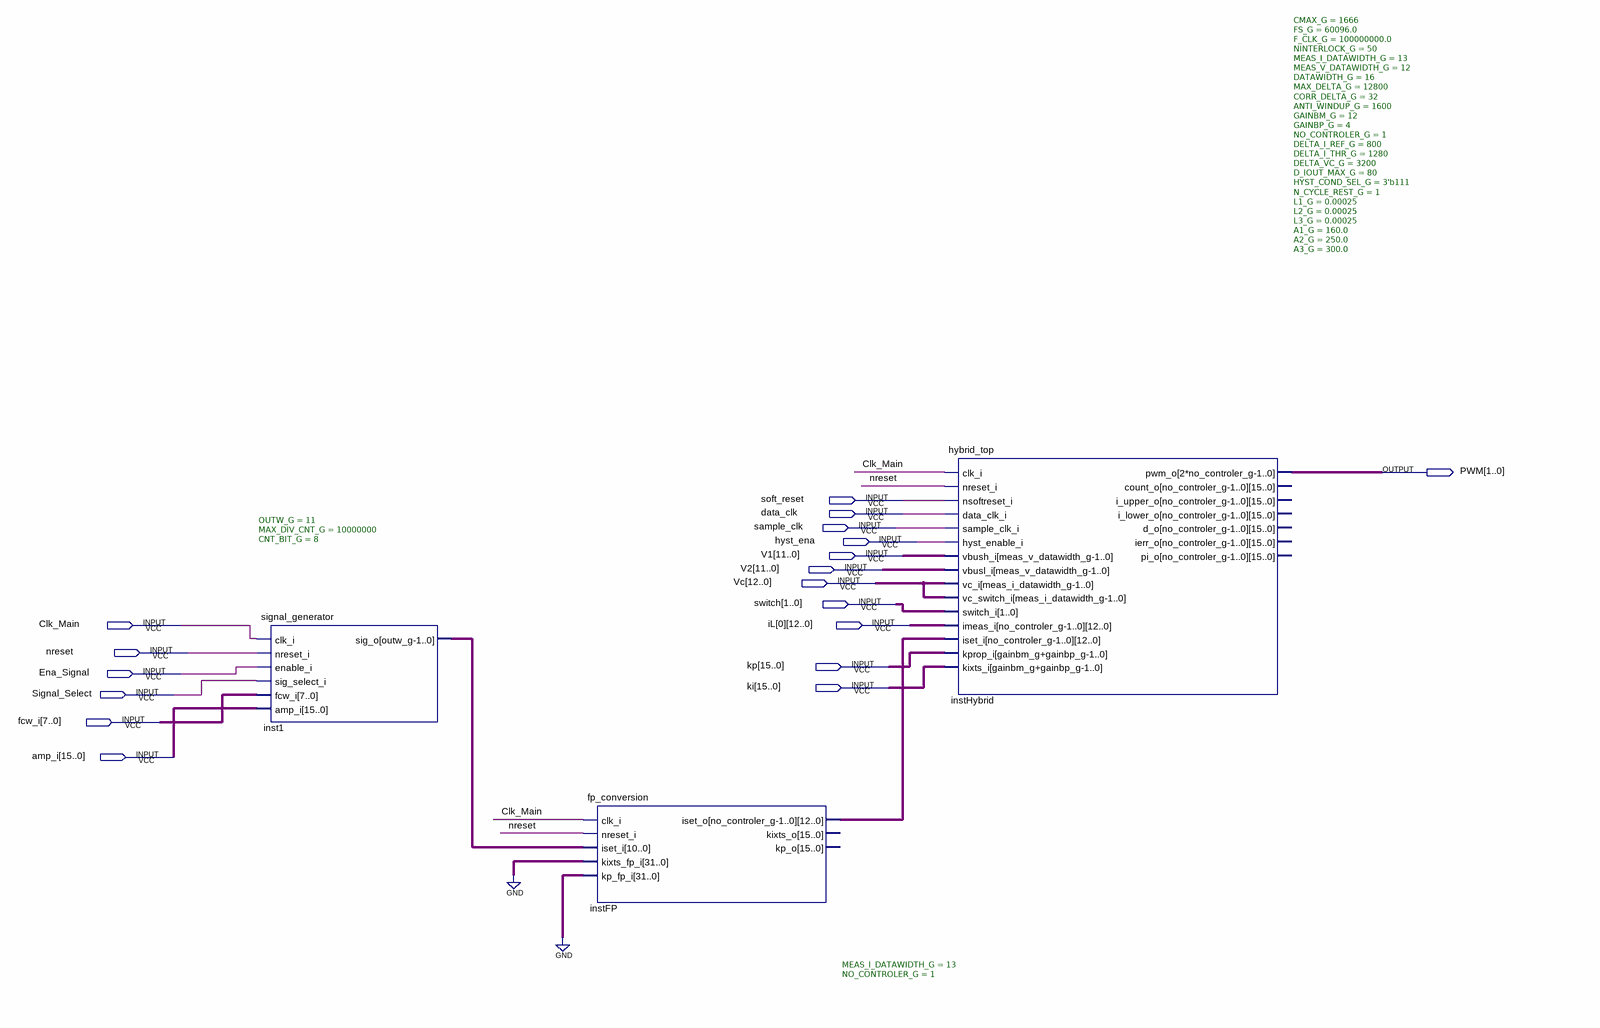
[diagram p0: schematic sheet]
// Quartus schematic schem_toplevel.bdf as structural Verilog: 3 symbols, 18 pins
module schem_toplevel (
  input  soft_reset,
  input  data_clk,
  input  sample_clk,
  input  hyst_ena,
  input  [11:0] V1,
  input  [11:0] V2,
  input  [12:0] Vc,
  input  [1:0] switch,
  input  Clk_Main,
  input  [12:0] iL_0,
  input  nreset,
  input  [15:0] kp,
  input  Ena_Signal,
  input  [15:0] ki,
  input  Signal_Select,
  input  [7:0] fcw_i,
  input  [15:0] amp_i,
  output [1:0] PWM
);

  wire [10:0] inst1_sig_o;
  wire [12:0] instFP_iset_o;

  signal_generator #(.OUTW_G(11), .MAX_DIV_CNT_G(10000000), .CNT_BIT_G(8)) inst1 (
    .clk_i(Clk_Main), .nreset_i(nreset), .enable_i(Ena_Signal), .sig_select_i(Signal_Select), .fcw_i(fcw_i),
    .amp_i(amp_i), .sig_o(inst1_sig_o));
  fp_conversion #(.MEAS_I_DATAWIDTH_G(13), .NO_CONTROLER_G(1)) instFP (
    .clk_i(Clk_Main), .nreset_i(nreset), .iset_i(inst1_sig_o), .kixts_fp_i({32{1'b0}}), .kp_fp_i({32{1'b0}}),
    .iset_o(instFP_iset_o));  // open: kixts_o, kp_o
  hybrid_top #(.CMAX_G(1666), .FS_G(60096.0), .F_CLK_G(100000000.0), .NINTERLOCK_G(50), .MEAS_I_DATAWIDTH_G(13), .MEAS_V_DATAWIDTH_G(12), .DATAWIDTH_G(16), .MAX_DELTA_G(12800), .CORR_DELTA_G(32), .ANTI_WINDUP_G(1600), .GAINBM_G(12), .GAINBP_G(4), .NO_CONTROLER_G(1), .DELTA_I_REF_G(800), .DELTA_I_THR_G(1280), .DELTA_VC_G(3200), .D_IOUT_MAX_G(80), .HYST_COND_SEL_G(3'b111), .N_CYCLE_REST_G(1), .L1_G(0.00025), .L2_G(0.00025), .L3_G(0.00025), .A1_G(160.0), .A2_G(250.0), .A3_G(300.0)) instHybrid (
    .clk_i(Clk_Main), .nreset_i(nreset), .nsoftreset_i(soft_reset), .data_clk_i(data_clk),
    .sample_clk_i(sample_clk), .hyst_enable_i(hyst_ena), .vbush_i(V1), .vbusl_i(V2), .vc_i(Vc),
    .vc_switch_i(Vc), .switch_i(switch), .imeas_i(iL_0), .iset_i(instFP_iset_o), .kprop_i(kp), .kixts_i(ki),
    .pwm_o(PWM));  // open: count_o, i_upper_o, i_lower_o, d_o, ierr_o, pi_o
endmodule
